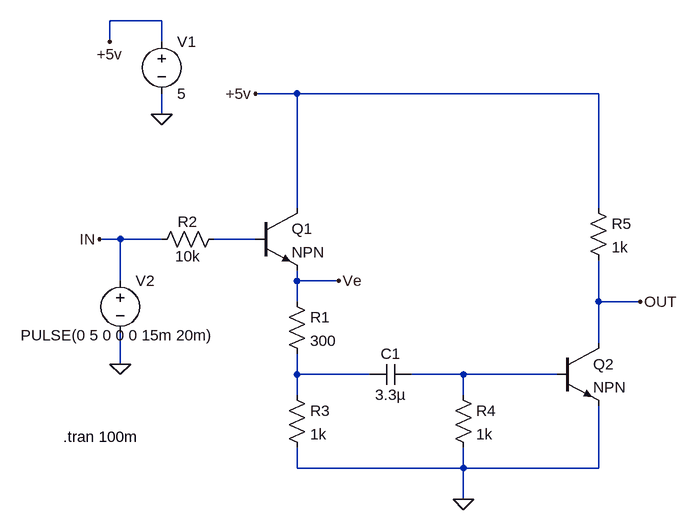
[diagram p0: schematic Draft3.asc]
Draft3.asc, the LTspice schematic file:
Version 4.1
SHEET 1 880 820
WIRE -16 64 -96 64
WIRE -96 96 -96 64
WIRE -16 96 -16 64
WIRE 192 176 128 176
WIRE 656 176 192 176
WIRE -16 208 -16 176
WIRE 192 352 192 176
WIRE 656 352 656 176
WIRE -80 400 -112 400
WIRE -16 400 -80 400
WIRE 128 400 64 400
WIRE -80 464 -80 400
WIRE 192 464 192 448
WIRE 256 464 192 464
WIRE 192 496 192 464
WIRE 656 496 656 432
WIRE 720 496 656 496
WIRE 656 560 656 496
WIRE -80 592 -80 544
WIRE 192 608 192 576
WIRE 304 608 192 608
WIRE 448 608 368 608
WIRE 592 608 448 608
WIRE 192 640 192 608
WIRE 448 640 448 608
WIRE 192 752 192 720
WIRE 448 752 448 720
WIRE 448 752 192 752
WIRE 656 752 656 656
WIRE 656 752 448 752
WIRE 448 800 448 752
FLAG -96 96 +5v
FLAG -16 208 0
FLAG 128 176 +5v
FLAG 448 800 0
FLAG 720 496 OUT
FLAG -80 592 0
FLAG -112 400 IN
FLAG 256 464 Ve
SYMBOL voltage -16 80 R0
WINDOW 123 0 0 Left 0
WINDOW 39 0 0 Left 0
SYMATTR InstName V1
SYMATTR Value 5
SYMBOL npn 128 352 R0
SYMATTR InstName Q1
SYMBOL res 176 480 R0
SYMATTR InstName R1
SYMATTR Value 300
SYMBOL res 80 384 R90
WINDOW 0 5 56 VBottom 2
WINDOW 3 27 56 VTop 2
SYMATTR InstName R2
SYMATTR Value 10k
SYMBOL cap 368 592 R90
WINDOW 0 0 32 VBottom 2
WINDOW 3 32 32 VTop 2
SYMATTR InstName C1
SYMATTR Value 3.3µ
SYMBOL res 176 624 R0
SYMATTR InstName R3
SYMATTR Value 1k
SYMBOL res 432 624 R0
SYMATTR InstName R4
SYMATTR Value 1k
SYMBOL res 640 336 R0
SYMATTR InstName R5
SYMATTR Value 1k
SYMBOL npn 592 560 R0
SYMATTR InstName Q2
SYMBOL voltage -80 448 R0
WINDOW 3 -153 100 Left 2
WINDOW 123 0 0 Left 0
WINDOW 39 0 0 Left 0
SYMATTR InstName V2
SYMATTR Value PULSE(0 5 0 0 0 15m 20m)
TEXT -168 704 Left 2 !.tran 100m

The netlist it stands for:
* Draft3.asc
V1 +5v 0 5
Q1 +5v N001 Ve 0 NPN
R1 Ve N002 300
R2 N001 IN 10k
C1 N003 N002 3.3µ
R3 N002 0 1k
R4 N003 0 1k
R5 +5v OUT 1k
Q2 OUT N003 0 0 NPN
V2 IN 0 PULSE(0 5 0 0 0 15m 20m)
.model NPN NPN
.model PNP PNP
.lib standard.bjt
.tran 100m
.backanno
.end

* Results of the author's LTspice run, read from the files saved beside the schematic
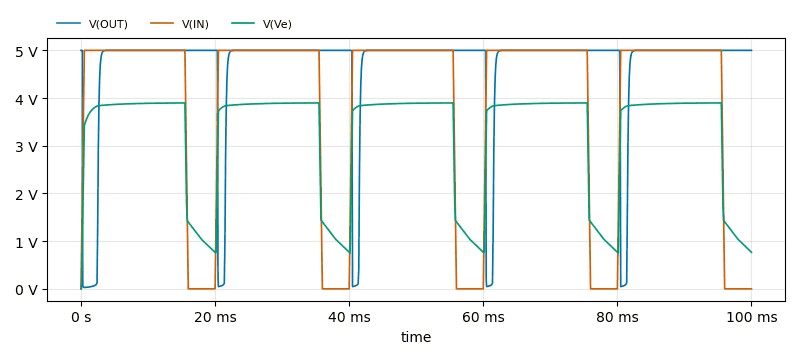
[diagram p1: Transient Analysis of Draft3.asc, plotted from the saved traces]
* Transient Analysis, 1 run:
*   V(OUT): min 27.78 mV, max 5 V, average 4.652 V, rms 4.81 V, last 5 V
*   V(IN): min 0 V, max 5 V, average 3.875 V, rms 4.379 V, last 0 V
*   V(Ve): min 0 V, max 3.898 V, average 3.214 V, rms 3.424 V, last 765.6 mV